# Altium schematic sheet lr3d.SchDoc
size A; SheetNumber: 20; SheetTotal: 20
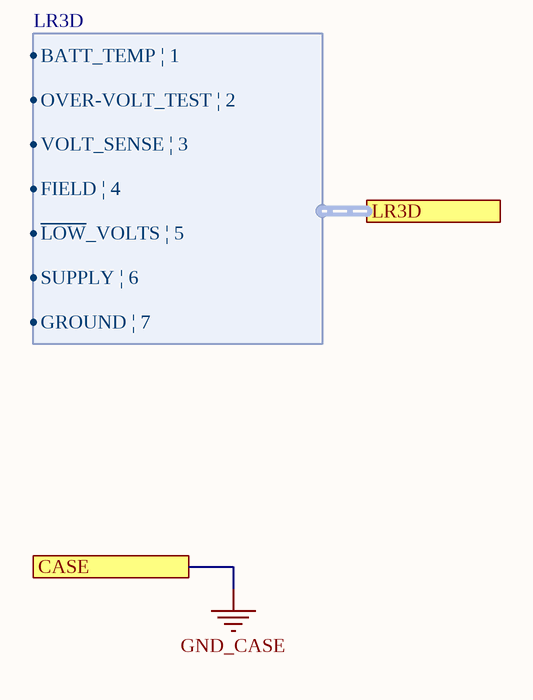
[diagram p0: lr3d.SchDoc]

## Ports
CASE, LR3D (harness LR3D)

## Harnesses
LR3D: BATT_TEMP | 1, OVER-VOLT_TEST | 2, VOLT_SENSE | 3, FIELD | 4, ~{LOW}_VOLTS | 5, SUPPLY | 6, GROUND | 7

## Nets
GND_CASE: port CASE